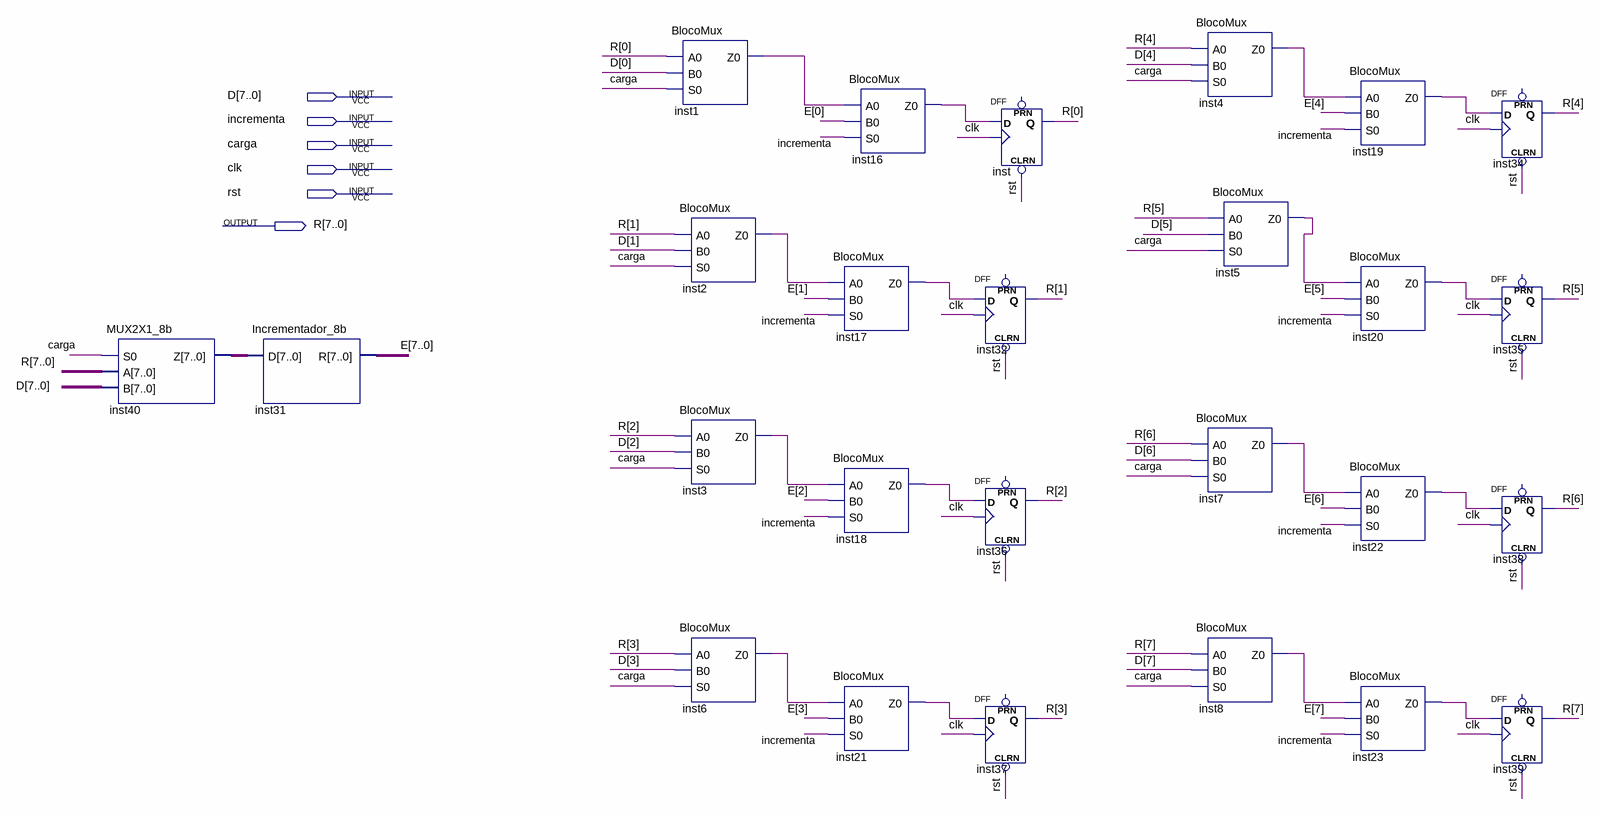
[diagram p0: schematic sheet]
// Quartus schematic PC.bdf as structural Verilog: 26 symbols, 6 pins
module PC (
  input  [7:0] D,
  input  incrementa,
  input  carga,
  input  clk,
  input  rst,
  output [7:0] R
);

  wire inst1_z0, inst2_z0, inst3_z0, inst4_z0, inst5_z0, inst6_z0, inst7_z0, inst8_z0, inst16_z0, inst17_z0,
       inst18_z0, inst19_z0, inst20_z0, inst21_z0, inst22_z0, inst23_z0;
  wire [7:0] E, inst40_z;

  MUX2X1_8b inst40 (.S0(carga), .A(R), .B(D), .Z(inst40_z));
  Incrementador_8b inst31 (.D(inst40_z), .R(E));
  BlocoMux inst1 (.A0(R[0]), .B0(D[0]), .S0(carga), .Z0(inst1_z0));
  BlocoMux inst2 (.A0(R[1]), .B0(D[1]), .S0(carga), .Z0(inst2_z0));
  BlocoMux inst3 (.A0(R[2]), .B0(D[2]), .S0(carga), .Z0(inst3_z0));
  BlocoMux inst6 (.A0(R[3]), .B0(D[3]), .S0(carga), .Z0(inst6_z0));
  BlocoMux inst16 (.A0(inst1_z0), .B0(E[0]), .S0(incrementa), .Z0(inst16_z0));
  BlocoMux inst17 (.A0(inst2_z0), .B0(E[1]), .S0(incrementa), .Z0(inst17_z0));
  BlocoMux inst18 (.A0(inst3_z0), .B0(E[2]), .S0(incrementa), .Z0(inst18_z0));
  BlocoMux inst21 (.A0(inst6_z0), .B0(E[3]), .S0(incrementa), .Z0(inst21_z0));
  DFF inst32 (.CLRN(rst), .CLK(clk), .D(inst17_z0), .Q(R[1]));  // open: PRN
  DFF inst36 (.CLRN(rst), .CLK(clk), .D(inst18_z0), .Q(R[2]));  // open: PRN
  DFF inst37 (.CLRN(rst), .CLK(clk), .D(inst21_z0), .Q(R[3]));  // open: PRN
  DFF inst (.CLRN(rst), .CLK(clk), .D(inst16_z0), .Q(R[0]));  // open: PRN
  BlocoMux inst4 (.A0(R[4]), .B0(D[4]), .S0(carga), .Z0(inst4_z0));
  BlocoMux inst5 (.A0(R[5]), .B0(D[5]), .S0(carga), .Z0(inst5_z0));
  BlocoMux inst7 (.A0(R[6]), .B0(D[6]), .S0(carga), .Z0(inst7_z0));
  BlocoMux inst8 (.A0(R[7]), .B0(D[7]), .S0(carga), .Z0(inst8_z0));
  BlocoMux inst19 (.A0(inst4_z0), .B0(E[4]), .S0(incrementa), .Z0(inst19_z0));
  BlocoMux inst20 (.A0(inst5_z0), .B0(E[5]), .S0(incrementa), .Z0(inst20_z0));
  BlocoMux inst22 (.A0(inst7_z0), .B0(E[6]), .S0(incrementa), .Z0(inst22_z0));
  BlocoMux inst23 (.A0(inst8_z0), .B0(E[7]), .S0(incrementa), .Z0(inst23_z0));
  DFF inst34 (.CLRN(rst), .CLK(clk), .D(inst19_z0), .Q(R[4]));  // open: PRN
  DFF inst35 (.CLRN(rst), .CLK(clk), .D(inst20_z0), .Q(R[5]));  // open: PRN
  DFF inst38 (.CLRN(rst), .CLK(clk), .D(inst22_z0), .Q(R[6]));  // open: PRN
  DFF inst39 (.CLRN(rst), .CLK(clk), .D(inst23_z0), .Q(R[7]));  // open: PRN
endmodule
